# Altium schematic sheet MCU.SchDoc: MCU
size A; Author: Alexander Curtiss; DocumentNumber: 2; SheetNumber: 2; SheetTotal: 6
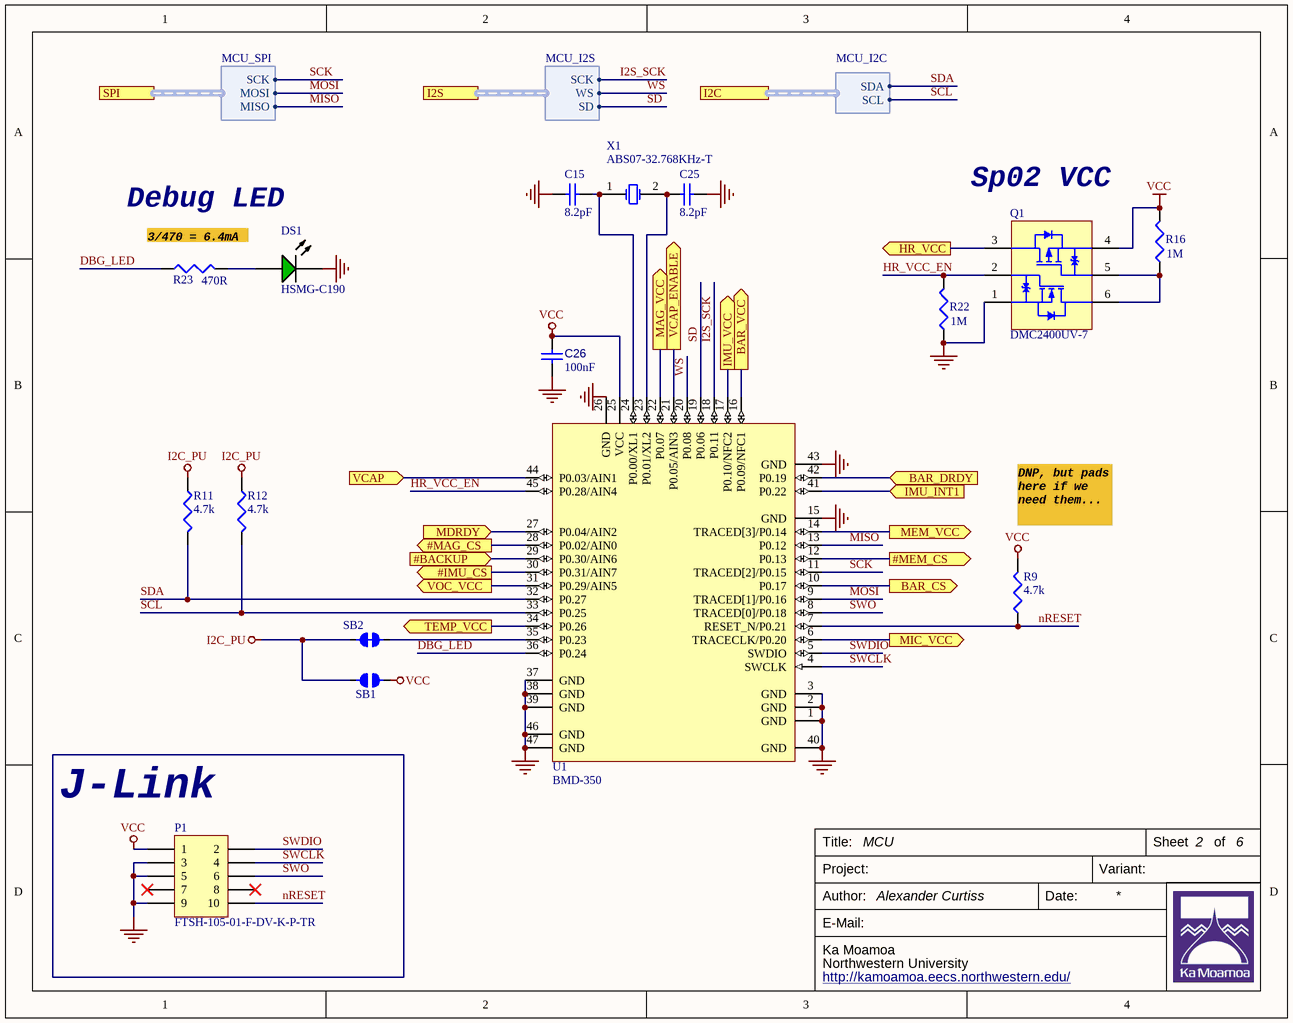
[diagram p0: MCU.SchDoc]

## Parts
C15  8.2pF  [CAPC1005X56X25NL10T15]
C25  8.2pF  [CAPC1005X56X25NL10T15]
C26  value 100nF  [CAPC0402(1005)60_L]  (hidden comment: Capacitor 100nF +/-20% 25V 0402)
DS1  HSMG-C190  [AVAG-HSMX-C190_V]
P1  FTSH-105-01-F-DV-K-P-TR  [FTSH-105-01-F-DV-K-P-TR-Footprint-1]
Q1  DMC2400UV-7  [DIOD-SOT563-6_V]
R9  4.7k  [RESC1608X55X25NL10T15]
R11  4.7k  [RESC1608X55X25NL10T15]
R12  4.7k  [RESC1608X55X25NL10T15]
R16  1M  [RESC1608X55X25NL10T15]
R22  1M  [RESC1608X55X25NL10T15]
R23  470R  [RESC1608X55X25NL10T15]
SB1  Solder Bridge  [Solder Bridge-Footprint-1]  (value not drawn)  (no BOM)
SB2  Solder Bridge NC  [Jumper NC-Footprint-1]  (value not drawn)  (net tie, no BOM)
U1  BMD-350  [BMD_LGA47S_865X640X150_CHIP]
X1  ABS07-32.768KHz-T  [ABRA-ABS07-2_V]

## Blocks framed on the sheet
J-Link: P1

## Ports
#BACKUP (in), #IMU_CS (out), #MAG_CS (out), #MEM_CS (out), BAR_CS (out), BAR_DRDY (in), BAR_VCC (out), HR_VCC (out), I2C (harness MCU_I2C), I2S (harness MCU_I2S), IMU_INT1 (in), IMU_VCC (out), MAG_VCC (out), MDRDY (in), MEM_VCC (out), MIC_VCC (out), SPI (harness MCU_SPI), TEMP_VCC (out), VCAP (in), VCAP_ENABLE (out), VOC_VCC (out)

## Harnesses
MCU_SPI: MISO, MOSI, SCK
MCU_I2S: SD, WS, SCK
MCU_I2C: SCL, SDA

## Nets
GND: C15.1 C25.1 C26.2 DS1.2(K) P1.3 P1.5 P1.9 Q1.1(S1) R22.1 U1.1(GND) U1.2(GND) U1.3(GND) U1.15(GND) U1.26(GND) U1.37(GND) U1.38(GND) U1.39(GND) U1.40(GND) U1.43(GND) U1.46(GND) U1.47(GND)
I2C_PU: R11.2 R12.2 SB1.1 SB2.1
VCC: C26.1 P1.1 Q1.4(S2) R9.2 R16.2 SB1.2 U1.25(VCC)
#BACKUP: U1.29(P0.30/AIN6) ; port #BACKUP
#IMU_CS: U1.30(P0.31/AIN7) ; port #IMU_CS
#MAG_CS: U1.28(P0.02/AIN0) ; port #MAG_CS
#MEM_CS: U1.12(P0.13) ; port #MEM_CS
BAR_CS: U1.10(P0.17) ; port BAR_CS
BAR_DRDY: U1.42(P0.19) ; port BAR_DRDY
BAR_VCC: U1.16(P0.09/NFC1) ; port BAR_VCC
DBG_LED: R23.1 U1.36(P0.24)
HR_VCC: Q1.3(D2) ; port HR_VCC
HR_VCC_EN: Q1.2(G1) R22.2 U1.45(P0.28/AIN4)
I2S_SCK: U1.18(P0.11) ; port I2S.SCK
IMU_INT1: U1.41(P0.22) ; port IMU_INT1
IMU_VCC: U1.17(P0.10/NFC2) ; port IMU_VCC
MAG_VCC: U1.22(P0.07) ; port MAG_VCC
MDRDY: U1.27(P0.04/AIN2) ; port MDRDY
MEM_VCC: U1.14(TRACED[3]/P0.14) ; port MEM_VCC
MIC_VCC: U1.6(TRACECLK/P0.20) ; port MIC_VCC
MISO: U1.13(P0.12) ; port SPI.MISO
MOSI: U1.9(TRACED[1]/P0.16) ; port SPI.MOSI
nRESET: P1.10 R9.1 U1.7(RESET_N/P0.21)
SCK: U1.11(TRACED[2]/P0.15) ; port SPI.SCK
SCL: R12.1 U1.33(P0.25) ; port I2C.SCL
SD: U1.19(P0.06) ; port I2S.SD
SDA: R11.1 U1.32(P0.27) ; port I2C.SDA
SWCLK: P1.4 U1.4(SWCLK)
SWDIO: P1.2 U1.5(SWDIO)
SWO: P1.6 U1.8(TRACED[0]/P0.18)
TEMP_VCC: U1.34(P0.26) ; port TEMP_VCC
VCAP: U1.44(P0.03/AIN1) ; port VCAP
VCAP_ENABLE: U1.21(P0.05/AIN3) ; port VCAP_ENABLE
VOC_VCC: U1.31(P0.29/AIN5) ; port VOC_VCC
WS: U1.20(P0.08) ; port I2S.WS
NetC15_2: C15.2 U1.24(P0.00/XL1) X1.1(X1)
NetC25_2: C25.2 U1.23(P0.01/XL2) X1.2(X2)
NetDS1_1: DS1.1(A) R23.2
NetQ1_5: Q1.5(G2) Q1.6(D1) R16.1
NetSB2_2: SB2.2 U1.35(P0.23)

Not connected (* = marked no-connect by the designer): P1 7* 8*

## Notes on the sheet
- Debug LED
- 3/470 = 6.4mA
- Sp02 VCC
- (near R9) DNP, but pads here if we need them...
- Title:
- Sheet
- of
- Project:
- Author:
- Date:
- Variant:
- Ka Moamoa
- Northwestern University
- http://kamoamoa.eecs.northwestern.edu/
- E-Mail:

## Library data of the parts
C15 C25 = CMP-2008-02690-1: Part Number: 04025A8R2JAT2A; Manufacturer: AVX Interconnect / Elco
C26 = CMP-001-00065-2: Chip Capacitor, 100nF +/-20%, 25V, 0402, Thickness 0.6 mm; Tolerance: 10%; Pins: 2; Min Operating Temperature: -55°C; Max Operating Temperature: 85°C; Mounting Technology: SMT; Case/Package: 0603; Voltage Rating: 25V
DS1 = CMP-1744-00002-1: Chip LED, Green, 2.2 V, -40 to 85 degC, 2-Pin SMD, RoHS, Tape and Reel; Frequency: 400 KHz; Max Supply Voltage: 5.5 V; Access Time: 3500 ns; Clock Frequency: 100 KHz; Case\Package: SOIC; Density: 32 kb; Nominal Supply Current: 2 mA; Interface: Serial; Min Supply Voltage: 1.7 V; Packaging: Tape and Reel; PackageReference: HSMX-C190; ComponentLink2URL: http://docs.avagotech.com/docs/AV02-0551EN; RoHSCompliant: true; Pins: 8; REACH SVHC: No SVHC; Max Operating Temperature: 85 degC; Width: 4 mm; Radiation Hardening: No; Package Quantity: 3000; ComponentLink3Description: Package Specification; ComponentLink1Description: Manufacturer URL; Min Operating Temperature: -40 degC; PackageDescription: 2-Pin Surface Mount Device, Body 1.6 x 0.8 mm, Height 0.9 mm; Max Clock Frequency: 100 KHz; Height: 1.5 mm; ComponentLink1URL: http://www.avagotech.com/; DatasheetVersion: Mar-12; ComponentLink2Description: Datasheet; Mount: Surface Mount; Length: 5 mm; ComponentLink3URL: http://www.fairchildsemi.com/dwg/MA/MA03D.pdf
P1 = CMP-00000-3: CONN HEADER SMD 10POS 1.27MM; Number of Contacts: 10; Row Spacing: 0.05inch; Connector Type: Male Pin; Housing Color: Black; Housing Material: Polymer; Min Operating Temperature: -55°C; Pitch: 1.27mm; Contact Material: Bronze; Mount: Surface Mount; Color: Black; Number of Rows: 2; Length: 6.35mm; Package Quantity: 500; Lead Free: Lead Free; Packaging: Tape and Reel; Termination: Solder; Contact Mating Length: 0.12inch; Depth: 5.84mm; Max Operating Temperature: 125°C; Contact Plating: Gold; Radiation Hardening: No; Number of Positions: 10; Orientation: Straight
Q1 = CMP-2000-06168-1: Complementary Pair Enhancement Mode MOSFET, 20 V N-Channel, -20 V P-Channel, -55 to 150 degC, 6-Pin SOTFL (SOT563), RoHS, Tape and Reel; Manufacturer: Diodes Inc; Channel Type: N,P; Maximum Power Dissipation: 1W; Typical Gate Charge @ Vgs: 0.5nC@4.5V; Typical Input Capacitance @ Vds: 37.1pF@10V; Maximum Gate Source Voltage: ±12(Q1)V,±8(Q2)V; Maximum Drain Source Resistance: 1.5Ω; Transistor Material: Si; Maximum Continuous Drain Current: 0.7A,1A; Typical Turn-Off Delay Time: 13.74ns; Number of Elements per Chip: 2; Maximum Drain Source Voltage: 20V; Maximum Gate Threshold Voltage: 1V; Transistor Configuration: Isolated; Typical Turn-On Delay Time: 4.06ns; Length: 1.7mm; Height: 0.6mm; Width: 1.25mm; Pin Count: 6; Minimum Operating Temperature: -55°C; Dimensions: 1.7x1.25x0.6mm; Package Type: SOT-563; Category: PowerMOSFET; Maximum Operating Temperature: +150°C; Manufacturer URL: http://www.diodes.com/; Channel Mode: Enhancement; Package Reference: SOT563-6; Mounting Technology: SurfaceMount; Datasheet URL: http://www.diodes.com/_files/datasheets/DMC2400UV.pdf; Package Description: 6-Pin Small Outline Transistor, Flat Lead, Body 1.175 x 1.6 mm, Pitch 0.5 mm; Mounting Type: SurfaceMount; Datasheet Version: Rev. 7-2, 06/2013
R9 R11 R12 = CMP-009-00177-2: Resistor 4.7kΩ 1% 0603; Manufacturer 1: Panasonic; Manufacturer Part Number 1: ERJ-3EKF4701V; Resistance: 4.7kR; Temperature Coefficient: 100ppm/°C; Power Rating: 100mW; Voltage Rating: 75V; Supplier 1: Digi-Key; Supplier Part Number 1: P4.70KHCT-ND; RoHS: Yes; Category: Chip SMD Resistors; Stock 1: 17388; Pricing 1: 1=0.10000, 10=0.03200, 100=0.01300, 1000=0.00583, 2500=0.00506 (USD); Mount: Surface Mount; Case/Package: 0603; Number of Pins: 2; Case Code (Metric): 1608; Case Code (Imperial): 0603; Contact Plating: Tin; Weight: 7.1E-05oz; Min Operating Temperature: -55°C; Max Operating Temperature: 155°C; Tolerance: 1%; Packaging: Tape and Reel; Resistor Type: Thick Film; Voltage Rating (DC): 75V; Number of Terminations: 2; Max Power Dissipation: 100mW; Termination: SMD/SMT; Package Quantity: 1; Features: Automotive AEC-Q200; Length: 1.6mm; Width: 0.031inch; Height: 0.022inch; Depth: 0.8mm; Radiation Hardening: No; Military Standard: Not; Lead Free: Lead Free; REACH SVHC: No SVHC; ComponentLink1URL: https://datasheet.ciiva.com/16449/aoa0000ce2-16449479.pdf?src-supplier=Future+Electronics; ComponentLink1Description: https://datasheet.ciiva.com/16449/aoa0000ce2-16449479.pdf?src-supplier=Future+Electronics; ComponentLink2URL: https://datasheet.ciiva.com/9195/aoa0000ce2-9195740.pdf?src-supplier=Avnet; ComponentLink2Description: https://datasheet.ciiva.com/9195/aoa0000ce2-9195740.pdf?src-supplier=Avnet; ComponentLink3URL: https://datasheet.ciiva.com/16758/70260748-16758189.pdf?src-supplier=Allied+Electronics; ComponentLink3Description: https://datasheet.ciiva.com/16758/70260748-16758189.pdf?src-supplier=Allied+Electronics; ComponentLink4URL: https://datasheet.ciiva.com/24160/aoa0000ce2-24160445.pdf?src-supplier=Mouser; ComponentLink4Description: https://datasheet.ciiva.com/24160/aoa0000ce2-24160445.pdf?src-supplier=Mouser; ComponentLink5URL: https://datasheet.ciiva.com/46372/1678782-46372717.pdf?src-supplier=Element14; ComponentLink5Description: https://datasheet.ciiva.com/46372/1678782-46372717.pdf?src-supplier=Element14; ComponentLink6URL: https://datasheet.ciiva.com/7830/aoa0000ce2-7830735.pdf?src-supplier=Element14; ComponentLink6Description: https://datasheet.ciiva.com/7830/aoa0000ce2-7830735.pdf?src-supplier=Element14; ComponentLink7URL: https://datasheet.ciiva.com/16511/aoa0000ce2-16511783.pdf?src-supplier=Avnet+Asia; ComponentLink7Description: https://datasheet.ciiva.com/16511/aoa0000ce2-16511783.pdf?src-supplier=Avnet+Asia; ComponentLink8URL: https://datasheet.ciiva.com/7830/426256-7830985.pdf?src-supplier=Element14; ComponentLink8Description: https://datasheet.ciiva.com/7830/426256-7830985.pdf?src-supplier=Element14; ComponentLink9URL: https://datasheet.ciiva.com/46372/1678782-46372716.pdf?src-supplier=Element14; ComponentLink9Description: https://datasheet.ciiva.com/46372/1678782-46372716.pdf?src-supplier=Element14; ComponentLink10URL: https://datasheet.ciiva.com/17213/aoa0000ce2-17213182.pdf?src-supplier=Avnet+Europe; ComponentLink10Description: https://datasheet.ciiva.com/17213/aoa0000ce2-17213182.pdf?src-supplier=Avnet+Europe
R16 R22 = CMP-009-00177-2: Resistor =Value =Tolerance 0603; Manufacturer 1: Vishay; Manufacturer Part Number 1: CRCW06031M00FKEA; Tolerance: 1%; Resistance: 1MR; Temperature Coefficient: 100ppm/°C; Power Rating: 100mW; Voltage Rating: 75V; Supplier 1: Digi-Key; Supplier Part Number 1: 541-1.00MHCT-ND; RoHS: Yes; Category: Chip SMD Resistors; Stock 1: 268304; Pricing 1: 1=0.10000, 10=0.03100, 100=0.01260, 1000=0.00567, 2500=0.00492 (USD); Mount: Surface Mount; Case/Package: 0603; Number of Pins: 2; Case Code (Imperial): 0603; Case Code (Metric): 1608; Contact Plating: Tin; Weight: 7.1E-05oz; Min Operating Temperature: -55°C; Max Operating Temperature: 155°C; Packaging: Tape and Reel; Resistor Type: Thick Film; Number of Terminations: 2; Package Quantity: 10; Max Power Dissipation: 100mW; Termination: SMD/SMT; Features: Automotive AEC-Q200; Voltage Rating (DC): 75V; Length: 1.55mm; Width: 0.85mm; Height: 0.45mm; Depth: 0.85mm; Radiation Hardening: No; Lead Free: Lead Free; Military Standard: Not; REACH SVHC: Unknown; ComponentLink1URL: https://datasheet.ciiva.com/11809/0900766b80d98afc-11809074.pdf?src-supplier=RSComponents; ComponentLink1Description: https://datasheet.ciiva.com/11809/0900766b80d98afc-11809074.pdf?src-supplier=RSComponents; ComponentLink2URL: https://datasheet.ciiva.com/16311/dcrcwe3-16311533.pdf?src-supplier=Future+Electronics; ComponentLink2Description: https://datasheet.ciiva.com/16311/dcrcwe3-16311533.pdf?src-supplier=Future+Electronics; ComponentLink3URL: https://datasheet.ciiva.com/7841/125364-7841823.pdf?src-supplier=Element14; ComponentLink3Description: https://datasheet.ciiva.com/7841/125364-7841823.pdf?src-supplier=Element14; ComponentLink4URL: https://datasheet.ciiva.com/26314/fld-crcw-e3-data-en-26314645.pdf?src-supplier=Distrelec; ComponentLink4Description: https://datasheet.ciiva.com/26314/fld-crcw-e3-data-en-26314645.pdf?src-supplier=Distrelec; ComponentLink5URL: https://datasheet.ciiva.com/2465/dcrcwe3-2465549.pdf?src-supplier=Digi-Key; ComponentLink5Description: https://datasheet.ciiva.com/2465/dcrcwe3-2465549.pdf?src-supplier=Digi-Key; ComponentLink6URL: https://datasheet.ciiva.com/2465/dcrcwe3-2465550.pdf?src-supplier=Digi-Key; ComponentLink6Description: https://datasheet.ciiva.com/2465/dcrcwe3-2465550.pdf?src-supplier=Digi-Key; ComponentLink7URL: https://datasheet.ciiva.com/7841/1720486-7841822.pdf?src-supplier=Element14; ComponentLink7Description: https://datasheet.ciiva.com/7841/1720486-7841822.pdf?src-supplier=Element14; ComponentLink8URL: https://datasheet.ciiva.com/2465/dcrcwe3-2465551.pdf?src-supplier=Digi-Key; ComponentLink8Description: https://datasheet.ciiva.com/2465/dcrcwe3-2465551.pdf?src-supplier=Digi-Key
R23 = CMP-009-00177-2: Resistor 470Ω 1% 0603; Manufacturer 1: Panasonic; Manufacturer Part Number 1: ERJ3EKF4700V; Temperature Coefficient: 100ppm/°C; Power Rating: 100mW; Voltage Rating: 75V; Supplier 1: Digi-Key; Supplier Part Number 1: P470HCT-ND; RoHS: Yes; Category: Chip SMD Resistors; Stock 1: 57256; Pricing 1: 1=0.10000, 10=0.03200, 100=0.01300, 1000=0.00583, 2500=0.00506 (USD); Mount: Surface Mount; Case/Package: 0603; Number of Pins: 2; Case Code (Metric): 1608; Case Code (Imperial): 0603; Contact Plating: Tin; Min Operating Temperature: -55°C; Max Operating Temperature: 155°C; Packaging: Tape and Reel; Resistance: 470R; Tolerance: 1%; Termination: SMD/SMT; Package Quantity: 5000; Resistor Type: Thick Film; Number of Terminations: 2; Max Power Dissipation: 100mW; Features: Automotive AEC-Q200; Voltage Rating (DC): 75V; Length: 1.6mm; Width: 0.8mm; Height: 0.45mm; Depth: 0.8mm; Radiation Hardening: No; Lead Free: Lead Free; REACH SVHC: No SVHC; Military Standard: Not; ComponentLink1URL: https://datasheet.ciiva.com/16440/aoa0000ce2-16440182.pdf?src-supplier=Future+Electronics; ComponentLink1Description: https://datasheet.ciiva.com/16440/aoa0000ce2-16440182.pdf?src-supplier=Future+Electronics; ComponentLink2URL: https://datasheet.ciiva.com/6138/aoa0000ce2-6138151.pdf?src-supplier=Farnell; ComponentLink2Description: https://datasheet.ciiva.com/6138/aoa0000ce2-6138151.pdf?src-supplier=Farnell; ComponentLink3URL: https://datasheet.ciiva.com/15159/getdatasheetpartid-45800-15159559.pdf?src-supplier=Verical; ComponentLink3Description: https://datasheet.ciiva.com/15159/getdatasheetpartid-45800-15159559.pdf?src-supplier=Verical; ComponentLink4URL: https://datasheet.ciiva.com/22687/1678782-22687447.pdf?src-supplier=Element14; ComponentLink4Description: https://datasheet.ciiva.com/22687/1678782-22687447.pdf?src-supplier=Element14; ComponentLink5URL: https://datasheet.ciiva.com/7830/426256-7830984.pdf?src-supplier=Element14; ComponentLink5Description: https://datasheet.ciiva.com/7830/426256-7830984.pdf?src-supplier=Element14; ComponentLink6URL: https://datasheet.ciiva.com/46372/1678782-46372969.pdf?src-supplier=Element14; ComponentLink6Description: https://datasheet.ciiva.com/46372/1678782-46372969.pdf?src-supplier=Element14; ComponentLink7URL: https://datasheet.ciiva.com/46372/1678782-46372970.pdf?src-supplier=Element14; ComponentLink7Description: https://datasheet.ciiva.com/46372/1678782-46372970.pdf?src-supplier=Element14; ComponentLink8URL: https://datasheet.ciiva.com/16784/70260748-16784891.pdf?src-supplier=Allied+Electronics; ComponentLink8Description: https://datasheet.ciiva.com/16784/70260748-16784891.pdf?src-supplier=Allied+Electronics; ComponentLink9URL: https://datasheet.ciiva.com/17205/aoa0000ce2-17205548.pdf?src-supplier=Avnet+Europe; ComponentLink9Description: https://datasheet.ciiva.com/17205/aoa0000ce2-17205548.pdf?src-supplier=Avnet+Europe; ComponentLink10URL: https://datasheet.ciiva.com/16773/70260748-16773597.pdf?src-supplier=Allied+Electronics; ComponentLink10Description: https://datasheet.ciiva.com/16773/70260748-16773597.pdf?src-supplier=Allied+Electronics; ComponentLink11URL: https://datasheet.ciiva.com/7830/aoa0000ce2-7830734.pdf?src-supplier=Element14; ComponentLink11Description: https://datasheet.ciiva.com/7830/aoa0000ce2-7830734.pdf?src-supplier=Element14; ComponentLink12URL: https://datasheet.ciiva.com/24069/aoa0000ce2-24069535.pdf?src-supplier=Mouser; ComponentLink12Description: https://datasheet.ciiva.com/24069/aoa0000ce2-24069535.pdf?src-supplier=Mouser
SB1 = CMP-009-00179-1: Normally open solder jumper
SB2 = CMP-009-00178-4: Normally closed solder jumper
U1 = CMP-003-0015-1: u-blox BMD-350 Bluetooth 5 module; Manufacturer P/N: BMD-350-A-R; Body Size: 8.65mm x 6.4mm; Internal Antenna: CHIP; Protocol: BT 5 LE, 2.4GHz Proprietary; Part Number: BMD-350; Manufacturer: u-blox; Design Item ID: BMD-350; Height: 1.5mm; Source: ubloxLib.SchLib
X1 = CMP-0447-00001-2: Crystal, 32.768 kHz, 12.5 pF, -40 to 85 degC, SMD Low Profile 3.2 x 1.5 x 0.9 mm, Tape and Reel; Manufacturer: Abracon; Q Value (Type): 30000; Operation Mode: Flexural Mode (Tuning Fork); Shunt Capacitance (C0): 0.9 to 1.2 pF; Load Capacitance (CL): 12.5 pF; Frequency Tolerance @+25degC: +/- 20 ppm; Drive Level (Type): 0.1 uW; Equivalent Series Resistance (R1): 70 Kohm; Insulation Resistance (Min): 500 Mohm; ComponentLink3URL: http://www.abracon.com/Resonators/ABS07.pdf; PackageDescription: 2-Pin Hand Drawn, Body 3.2x1.5mm, Pitch 2.5mm; Operating Temperature: -40 to 85 degC; ComponentLink2URL: http://www.abracon.com/Resonators/ABS07.pdf; PackageReference: ABS07-2; ComponentLink3Description: Package Specification; ComponentLink1Description: Manufacturer URL; DatasheetVersion: 04.03.13; Mounting Technology: Surface Mount; ComponentLink2Description: Datasheet; ComponentLink1URL: http://www.abracon.com/; PartNumber: ABS07-32.768KHz-T; Packing: Tape and Reel; Frequency: 32.768 kHz